# Altium schematic sheet Main.SchDoc
size A; SheetNumber: 1; SheetTotal: 5
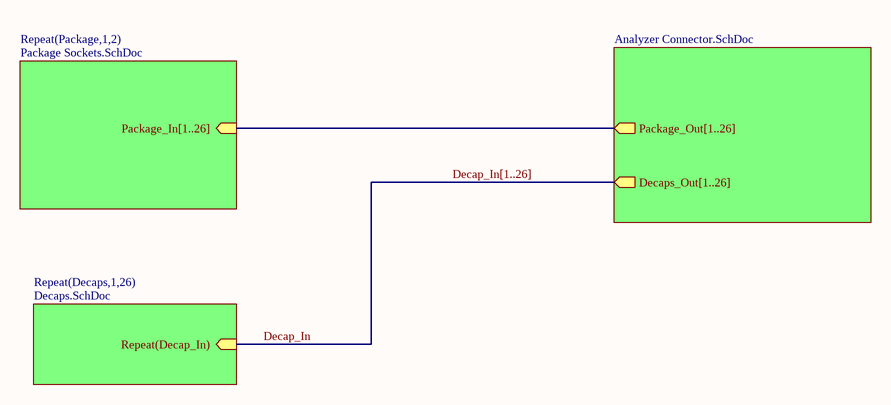
[diagram p0: Main.SchDoc]

## Sub-sheets
Repeat(Decaps,1,26) = Decaps.SchDoc: Repeat(Decap_In) (in)
Repeat(Package,1,2) = Package Sockets.SchDoc: Package_In[1..26] (in)
? = Analyzer Connector.SchDoc: Package_Out[1..26] (out), Decaps_Out[1..26] (out)

## Nets
Decap_In: sheet Repeat(Decaps,1,26)/Repeat(Decap_In)

## Buses and harness runs
bus Decap_In[1..26] = sheet /Decaps_Out[1..26]
bus sheet /Package_Out[1..26] = sheet Repeat(Package,1,2)/Package_In[1..26]